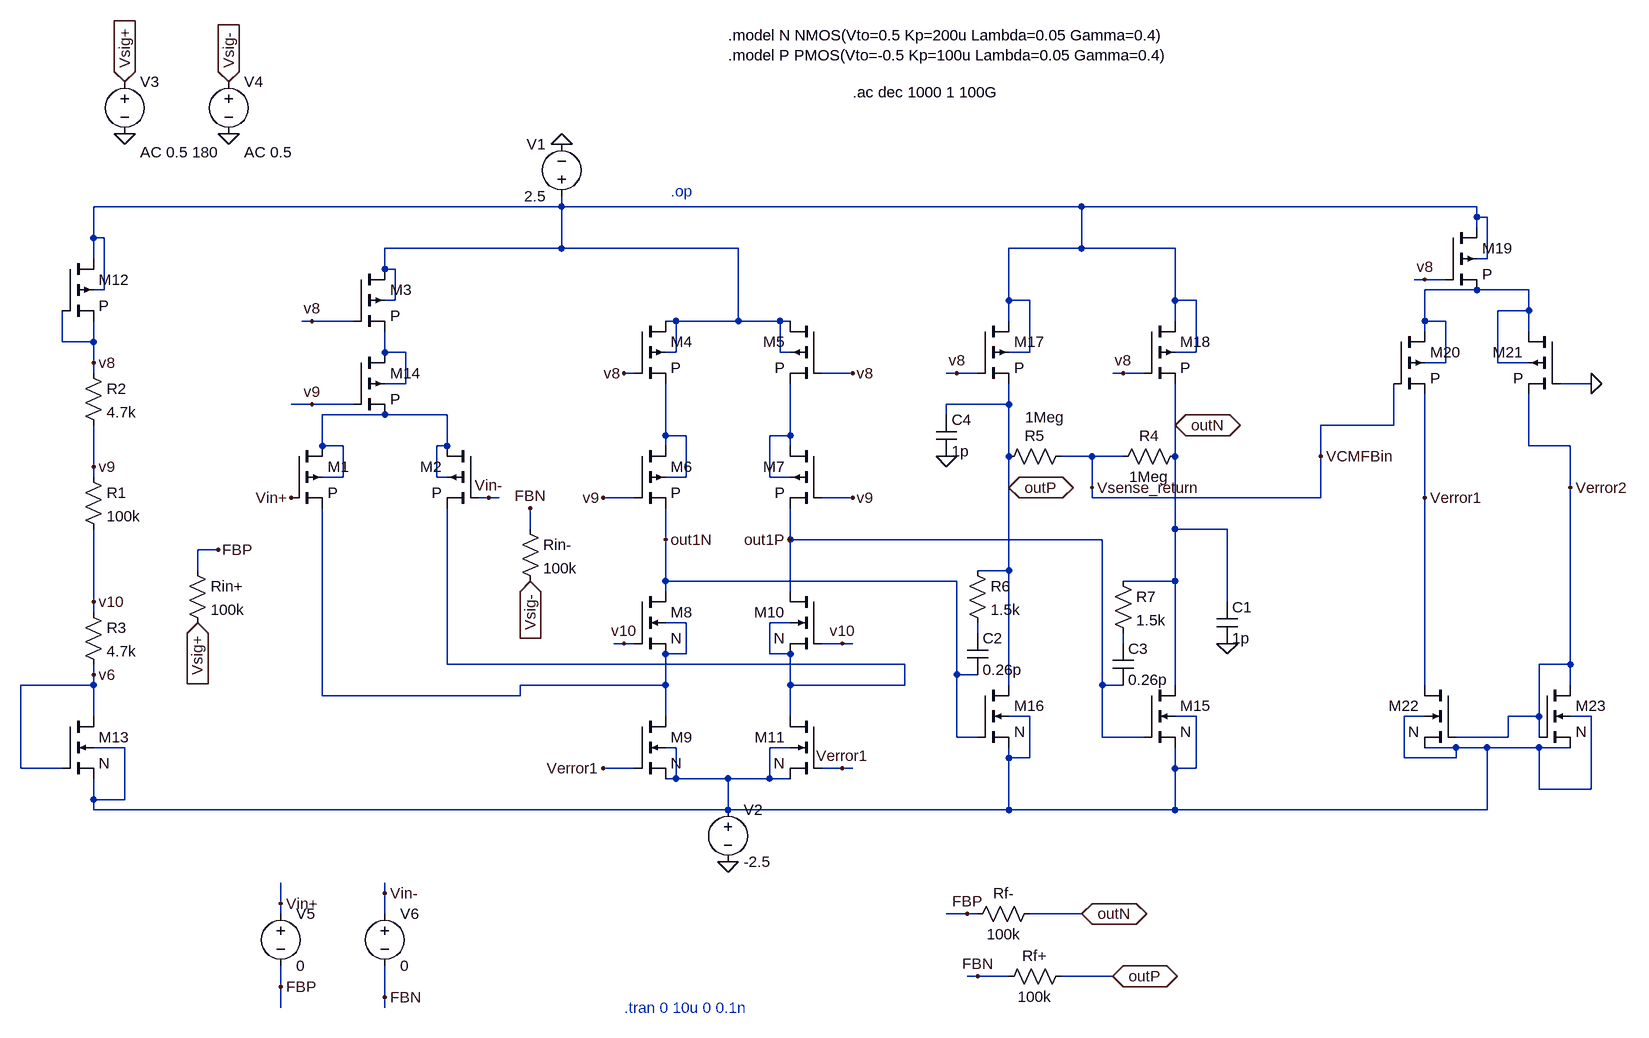
[diagram p0: schematic prototype-final.asc]
prototype-final.asc, the LTspice schematic file:
Version 4.1
SHEET 1 2264 2500
WIRE 560 352 560 336
WIRE 560 352 -160 352
WIRE 1360 352 560 352
WIRE 1968 352 1360 352
WIRE 1968 368 1968 352
WIRE 1984 368 1968 368
WIRE 1968 384 1968 368
WIRE -160 400 -160 352
WIRE -144 400 -160 400
WIRE 560 416 560 352
WIRE 560 416 288 416
WIRE 832 416 560 416
WIRE 1360 416 1360 352
WIRE 1360 416 1248 416
WIRE 1504 416 1360 416
WIRE -160 432 -160 400
WIRE 1984 432 1984 368
WIRE 1984 432 1968 432
WIRE 288 448 288 416
WIRE 304 448 288 448
WIRE 1888 464 1872 464
WIRE 1920 464 1888 464
WIRE -144 480 -144 400
WIRE -144 480 -160 480
WIRE 1968 480 1888 480
WIRE 2048 480 1968 480
WIRE 304 496 304 448
WIRE 304 496 288 496
WIRE 1248 496 1248 416
WIRE 1280 496 1248 496
WIRE 1504 496 1504 416
WIRE 1536 496 1504 496
WIRE 2048 512 2048 480
WIRE 2048 512 2000 512
WIRE 176 528 160 528
WIRE 240 528 176 528
WIRE 736 528 720 528
WIRE 832 528 832 416
WIRE 832 528 736 528
WIRE 896 528 832 528
WIRE 912 528 896 528
WIRE 1248 528 1248 496
WIRE 1504 528 1504 496
WIRE 1888 528 1888 480
WIRE 1920 528 1888 528
WIRE 1888 544 1888 528
WIRE 2048 544 2048 512
WIRE -208 560 -208 512
WIRE -160 560 -160 528
WIRE -160 560 -208 560
WIRE 288 576 288 544
WIRE 320 576 288 576
WIRE 736 576 736 528
WIRE 736 576 720 576
WIRE 896 576 896 528
WIRE 912 576 896 576
WIRE 1280 576 1280 496
WIRE 1280 576 1248 576
WIRE 1536 576 1536 496
WIRE 1536 576 1504 576
WIRE -160 592 -160 560
WIRE 1920 592 1920 528
WIRE 1920 592 1888 592
WIRE 2000 592 2000 512
WIRE 2048 592 2000 592
WIRE -160 608 -160 592
WIRE 672 608 656 608
WIRE 1008 608 960 608
WIRE 1168 608 1152 608
WIRE 1200 608 1168 608
WIRE 1424 608 1408 608
WIRE 1456 608 1424 608
WIRE 320 624 320 576
WIRE 320 624 288 624
WIRE 2144 624 2096 624
WIRE 176 656 144 656
WIRE 240 656 176 656
WIRE 1248 656 1248 624
WIRE 1248 656 1152 656
WIRE 288 672 192 672
WIRE 384 672 288 672
WIRE 1152 672 1152 656
WIRE 1504 688 1504 624
WIRE 1840 688 1840 624
WIRE 1840 688 1728 688
WIRE 720 704 720 624
WIRE 752 704 720 704
WIRE 912 704 912 624
WIRE 912 704 880 704
WIRE 192 720 192 672
WIRE 224 720 192 720
WIRE 384 720 384 672
WIRE 384 720 368 720
WIRE 720 720 720 704
WIRE 912 720 912 704
WIRE 2048 720 2048 640
WIRE 2112 720 2048 720
WIRE 1248 736 1248 656
WIRE 1376 736 1328 736
WIRE 1424 736 1376 736
WIRE 1504 736 1504 688
WIRE 1728 736 1728 688
WIRE -160 752 -160 688
WIRE -160 768 -160 752
WIRE 224 768 224 720
WIRE 224 768 192 768
WIRE 368 768 368 720
WIRE 384 768 368 768
WIRE 752 768 752 704
WIRE 752 768 720 768
WIRE 880 768 880 704
WIRE 912 768 880 768
WIRE 1248 784 1248 736
WIRE 1376 784 1376 736
WIRE 2112 784 2112 720
WIRE 448 800 432 800
WIRE 464 800 448 800
WIRE 672 800 624 800
WIRE 1008 800 960 800
WIRE 1376 800 1376 784
WIRE 1728 800 1728 736
WIRE 1728 800 1376 800
WIRE 1888 800 1888 640
WIRE 512 848 512 816
WIRE 1504 848 1504 736
WIRE 1584 848 1504 848
WIRE 720 864 720 816
WIRE 912 864 912 816
WIRE 1392 864 912 864
WIRE 32 880 0 880
WIRE 0 912 0 880
WIRE 1248 912 1248 784
WIRE 1248 912 1200 912
WIRE 720 928 720 864
WIRE 1168 928 720 928
WIRE 1504 928 1504 848
WIRE 1504 928 1424 928
WIRE 720 944 720 928
WIRE 912 944 912 864
WIRE -160 960 -160 848
WIRE 1584 960 1584 848
WIRE -160 976 -160 960
WIRE 752 992 720 992
WIRE 912 992 880 992
WIRE 1200 1008 1200 992
WIRE 656 1024 640 1024
WIRE 672 1024 656 1024
WIRE 992 1024 960 1024
WIRE 1008 1024 992 1024
WIRE 1424 1024 1424 1008
WIRE 752 1040 752 992
WIRE 752 1040 720 1040
WIRE 880 1040 880 992
WIRE 912 1040 880 1040
WIRE 384 1056 384 816
WIRE 1088 1056 384 1056
WIRE 2112 1056 2112 784
WIRE 2112 1056 2064 1056
WIRE -160 1072 -160 1056
WIRE 1168 1072 1168 928
WIRE 1200 1072 1168 1072
WIRE -160 1088 -160 1072
WIRE -160 1088 -272 1088
WIRE 720 1088 720 1040
WIRE 720 1088 496 1088
WIRE 912 1088 912 1040
WIRE 1088 1088 1088 1056
WIRE 1088 1088 912 1088
WIRE 1248 1088 1248 912
WIRE 1392 1088 1392 864
WIRE 1424 1088 1392 1088
WIRE 1504 1088 1504 928
WIRE 1888 1088 1888 800
WIRE 2112 1088 2112 1056
WIRE 192 1104 192 816
WIRE 496 1104 496 1088
WIRE 496 1104 192 1104
WIRE -160 1136 -160 1088
WIRE 720 1136 720 1088
WIRE 912 1136 912 1088
WIRE 1280 1136 1248 1136
WIRE 1536 1136 1504 1136
WIRE 1888 1136 1856 1136
WIRE 2064 1136 2064 1056
WIRE 2064 1136 2016 1136
WIRE 2144 1136 2112 1136
WIRE 1168 1168 1168 1072
WIRE 1200 1168 1168 1168
WIRE 1392 1168 1392 1088
WIRE 1456 1168 1392 1168
WIRE 2016 1168 2016 1136
WIRE 2016 1168 1936 1168
WIRE 2064 1168 2064 1136
WIRE -112 1184 -160 1184
WIRE 736 1184 720 1184
WIRE 912 1184 880 1184
WIRE 1936 1184 1888 1184
WIRE 1984 1184 1936 1184
WIRE 2064 1184 1984 1184
WIRE 2112 1184 2064 1184
WIRE 1248 1200 1248 1184
WIRE 1280 1200 1280 1136
WIRE 1280 1200 1248 1200
WIRE 1856 1200 1856 1136
WIRE 1936 1200 1936 1184
WIRE 1936 1200 1856 1200
WIRE -272 1216 -272 1088
WIRE -208 1216 -272 1216
WIRE 672 1216 624 1216
WIRE 992 1216 960 1216
WIRE 1008 1216 992 1216
WIRE 1504 1216 1504 1184
WIRE 1536 1216 1536 1136
WIRE 1536 1216 1504 1216
WIRE 736 1232 736 1184
WIRE 736 1232 720 1232
WIRE 816 1232 736 1232
WIRE 880 1232 880 1184
WIRE 880 1232 816 1232
WIRE 912 1232 880 1232
WIRE 2064 1248 2064 1184
WIRE 2144 1248 2144 1136
WIRE 2144 1248 2064 1248
WIRE -160 1264 -160 1232
WIRE -112 1264 -112 1184
WIRE -112 1264 -160 1264
WIRE -160 1280 -160 1264
WIRE 816 1280 816 1232
WIRE 816 1280 -160 1280
WIRE 1248 1280 1248 1200
WIRE 1248 1280 816 1280
WIRE 1504 1280 1504 1216
WIRE 1504 1280 1248 1280
WIRE 1984 1280 1984 1184
WIRE 1984 1280 1504 1280
WIRE 288 1408 288 1392
WIRE 128 1424 128 1392
WIRE 128 1440 128 1424
WIRE 288 1440 288 1408
WIRE 1184 1440 1152 1440
WIRE 1200 1440 1184 1440
WIRE 1360 1440 1280 1440
WIRE 1200 1536 1184 1536
WIRE 1248 1536 1200 1536
WIRE 1408 1536 1328 1536
WIRE 128 1552 128 1520
WIRE 288 1568 288 1520
WIRE 128 1584 128 1552
WIRE 288 1584 288 1568
FLAG 560 256 0
FLAG 816 1360 0
FLAG -112 240 0
FLAG 48 240 0
FLAG -112 160 Vsig+
IOPIN -112 160 In
FLAG 48 160 Vsig-
IOPIN 48 160 In
FLAG -160 592 v8
FLAG 656 608 v8
FLAG 1008 608 v8
FLAG -160 752 v9
FLAG 624 800 v9
FLAG 1008 800 v9
FLAG -160 960 v10
FLAG 656 1024 v10
FLAG 992 1024 v10
FLAG -160 1072 v6
FLAG 176 528 v8
FLAG 176 656 v9
FLAG 912 864 out1P
FLAG 720 864 out1N
FLAG 1168 608 v8
FLAG 1424 608 v8
FLAG 1584 1024 0
FLAG 1504 688 outN
IOPIN 1504 688 BiDir
FLAG 1248 784 outP
IOPIN 1248 784 BiDir
FLAG 1152 736 0
FLAG 1376 784 Vsense_return
FLAG 1888 464 v8
FLAG 2144 624 0
FLAG 1888 800 Verror1
FLAG 2112 784 Verror2
FLAG 624 1216 Verror1
FLAG 992 1216 Verror1
FLAG 0 992 Vsig+
IOPIN 0 992 In
FLAG 512 928 Vsig-
IOPIN 512 928 In
FLAG 144 800 Vin+
FLAG 448 800 Vin-
FLAG 1360 1440 outN
IOPIN 1360 1440 BiDir
FLAG 1408 1536 outP
IOPIN 1408 1536 BiDir
FLAG 1184 1440 FBP
FLAG 1200 1536 FBN
FLAG 128 1424 Vin+
FLAG 288 1408 Vin-
FLAG 128 1552 FBP
FLAG 288 1568 FBN
FLAG 32 880 FBP
FLAG 512 816 FBN
FLAG 1728 736 VCMFBin
DATAFLAG -192 560 ""
DATAFLAG -256 1088 ""
DATAFLAG 1168 1152 ""
DATAFLAG 1248 1232 ""
DATAFLAG 1248 1072 ""
DATAFLAG -160 704 ""
DATAFLAG -160 912 ""
SYMBOL pmos4 144 720 R0
SYMATTR InstName M1
SYMATTR Value P
SYMATTR Value2 l=2u w=50u
SYMBOL pmos4 432 720 M0
SYMATTR InstName M2
SYMATTR Value P
SYMATTR Value2 l=2u w=50u
SYMBOL pmos4 240 448 R0
SYMATTR InstName M3
SYMATTR Value P
SYMATTR Value2 l=2u w=100u
SYMBOL voltage 560 352 R180
WINDOW 0 24 96 Left 2
WINDOW 3 24 16 Left 2
WINDOW 123 0 0 Left 0
WINDOW 39 0 0 Left 0
SYMATTR InstName V1
SYMATTR Value 2.5
SYMBOL pmos4 672 528 R0
SYMATTR InstName M4
SYMATTR Value P
SYMATTR Value2 l=2u w=50u
SYMBOL pmos4 960 528 M0
SYMATTR InstName M5
SYMATTR Value P
SYMATTR Value2 l=2u w=50u
SYMBOL pmos4 672 720 R0
SYMATTR InstName M6
SYMATTR Value P
SYMATTR Value2 l=2u w=50u
SYMBOL pmos4 960 720 M0
SYMATTR InstName M7
SYMATTR Value P
SYMATTR Value2 l=2u w=50u
SYMBOL nmos4 672 944 R0
SYMATTR InstName M8
SYMATTR Value N
SYMATTR Value2 l=2u w=25u
SYMBOL nmos4 672 1136 R0
SYMATTR InstName M9
SYMATTR Value N
SYMATTR Value2 l=2u w=50u
SYMBOL nmos4 960 944 M0
SYMATTR InstName M10
SYMATTR Value N
SYMATTR Value2 l=2u w=25u
SYMBOL nmos4 960 1136 M0
SYMATTR InstName M11
SYMATTR Value N
SYMATTR Value2 l=2u w=50u
SYMBOL voltage 816 1264 R0
WINDOW 123 0 0 Left 0
WINDOW 39 0 0 Left 0
SYMATTR InstName V2
SYMATTR Value -2.5
SYMBOL voltage -112 144 R0
WINDOW 123 24 124 Left 2
WINDOW 39 0 0 Left 0
SYMATTR Value2 AC 0.5 180
SYMATTR InstName V3
SYMATTR Value ""
SYMBOL voltage 48 144 R0
WINDOW 123 24 124 Left 2
WINDOW 39 0 0 Left 0
SYMATTR Value2 AC 0.5
SYMATTR InstName V4
SYMATTR Value ""
SYMBOL pmos4 -208 432 R0
SYMATTR InstName M12
SYMATTR Value P
SYMATTR Value2 l=2u w=100u
SYMBOL nmos4 -208 1136 R0
SYMATTR InstName M13
SYMATTR Value N
SYMATTR Value2 l=2u w=50u
SYMBOL res -176 752 R0
SYMATTR InstName R1
SYMATTR Value 100k
SYMBOL res -176 592 R0
SYMATTR InstName R2
SYMATTR Value 4.7k
SYMBOL res -176 960 R0
SYMATTR InstName R3
SYMATTR Value 4.7k
SYMBOL pmos4 240 576 R0
SYMATTR InstName M14
SYMATTR Value P
SYMATTR Value2 l=2u w=100u
SYMBOL nmos4 1456 1088 R0
SYMATTR InstName M15
SYMATTR Value N
SYMATTR Value2 l=2u w=100u
SYMBOL nmos4 1200 1088 R0
SYMATTR InstName M16
SYMATTR Value N
SYMATTR Value2 l=2u w=100u
SYMBOL pmos4 1200 528 R0
SYMATTR InstName M17
SYMATTR Value P
SYMATTR Value2 l=2u w=200u
SYMBOL pmos4 1456 528 R0
SYMATTR InstName M18
SYMATTR Value P
SYMATTR Value2 l=2u w=200u
SYMBOL cap 1568 960 R0
SYMATTR InstName C1
SYMATTR Value 1p
SYMBOL cap 1136 672 R0
SYMATTR InstName C4
SYMATTR Value 1p
SYMBOL cap 1184 1008 R0
SYMATTR InstName C2
SYMATTR Value 0.26p
SYMBOL cap 1408 1024 R0
SYMATTR InstName C3
SYMATTR Value 0.26p
SYMBOL res 1520 720 R90
WINDOW 0 0 56 VBottom 2
WINDOW 3 32 56 VTop 2
SYMATTR InstName R4
SYMATTR Value 1Meg
SYMBOL res 1344 720 R90
WINDOW 0 0 56 VBottom 2
WINDOW 3 -60 40 VTop 2
SYMATTR InstName R5
SYMATTR Value 1Meg
SYMBOL pmos4 1920 384 R0
SYMATTR InstName M19
SYMATTR Value P
SYMATTR Value2 l=2u w=200u
SYMBOL pmos4 1840 544 R0
SYMATTR InstName M20
SYMATTR Value P
SYMATTR Value2 l=2u w=200u
SYMBOL pmos4 2096 544 M0
SYMATTR InstName M21
SYMATTR Value P
SYMATTR Value2 l=2u w=200u
SYMBOL nmos4 1936 1088 M0
SYMATTR InstName M22
SYMATTR Value N
SYMATTR Value2 l=2u w=100u
SYMBOL nmos4 2064 1088 R0
SYMATTR InstName M23
SYMATTR Value N
SYMATTR Value2 l=2u w=100u
SYMBOL res 1184 896 R0
SYMATTR InstName R6
SYMATTR Value 1.5k
SYMBOL res 1408 912 R0
SYMATTR InstName R7
SYMATTR Value 1.5k
SYMBOL res 496 832 R0
SYMATTR InstName Rin-
SYMATTR Value 100k
SYMBOL res -16 896 R0
SYMATTR InstName Rin+
SYMATTR Value 100k
SYMBOL res 1296 1424 R90
WINDOW 0 0 56 VBottom 2
WINDOW 3 32 56 VTop 2
SYMATTR InstName Rf-
SYMATTR Value 100k
SYMBOL res 1344 1520 R90
WINDOW 0 0 56 VBottom 2
WINDOW 3 32 56 VTop 2
SYMATTR InstName Rf+
SYMATTR Value 100k
SYMBOL voltage 128 1424 R0
WINDOW 123 24 124 Left 2
WINDOW 39 0 0 Left 0
SYMATTR InstName V5
SYMATTR Value 0
SYMBOL voltage 288 1424 R0
WINDOW 123 24 124 Left 2
WINDOW 39 0 0 Left 0
SYMATTR InstName V6
SYMATTR Value 0
TEXT 816 88 Left 2 !.model N NMOS(Vto=0.5 Kp=200u Lambda=0.05 Gamma=0.4)\n.model P PMOS(Vto=-0.5 Kp=100u Lambda=0.05 Gamma=0.4)
TEXT 728 328 Left 2 ;.op
TEXT 1008 176 Left 2 !.ac dec 1000 1 100G
TEXT 656 1584 Left 2 ;.tran 0 10u 0 0.1n

The netlist it stands for:
* prototype-final.asc
M1 N004 Vin+ N007 N004 P l=2u w=50u
M2 N004 Vin- N008 N004 P l=2u w=50u
M3 N001 v8 N003 N001 P l=2u w=100u
V1 N001 0 2.5
M4 N001 v8 N005 N001 P l=2u w=50u
M5 N001 v8 N006 N001 P l=2u w=50u
M6 N005 v9 out1N N005 P l=2u w=50u
M7 N006 v9 out1P N006 P l=2u w=50u
M8 out1N v10 N007 N007 N l=2u w=25u
M9 N007 Verror1 N011 N011 N l=2u w=50u
M10 out1P v10 N008 N008 N l=2u w=25u
M11 N008 Verror1 N011 N011 N l=2u w=50u
V2 N011 0 -2.5
V3 Vsig+ 0 AC 0.5 180
V4 Vsig- 0 AC 0.5
M12 N001 v8 v8 N001 P l=2u w=100u
M13 v6 v6 N011 N011 N l=2u w=50u
R1 v9 v10 100k
R2 v8 v9 4.7k
R3 v10 v6 4.7k
M14 N003 v9 N004 N003 P l=2u w=100u
M15 outN out1P N011 N011 N l=2u w=100u
M16 outP out1N N011 N011 N l=2u w=100u
M17 N001 v8 outP N001 P l=2u w=200u
M18 N001 v8 outN N001 P l=2u w=200u
C1 outN 0 1p
C4 outP 0 1p
C2 N009 out1N 0.26p
C3 N010 out1P 0.26p
R4 outN VCMFBin 1Meg
R5 VCMFBin outP 1Meg
M19 N001 v8 N002 N001 P l=2u w=200u
M20 N002 VCMFBin Verror1 N002 P l=2u w=200u
M21 N002 0 Verror2 N002 P l=2u w=200u
M22 Verror1 Verror2 N011 N011 N l=2u w=100u
M23 Verror2 Verror2 N011 N011 N l=2u w=100u
R6 outP N009 1.5k
R7 outN N010 1.5k
Rin- FBN Vsig- 100k
Rin+ FBP Vsig+ 100k
Rf- outN FBP 100k
Rf+ outP FBN 100k
V5 Vin+ FBP 0
V6 Vin- FBN 0
.model NMOS NMOS
.model PMOS PMOS
.lib standard.mos
.model N NMOS(Vto=0.5 Kp=200u Lambda=0.05 Gamma=0.4)
.model P PMOS(Vto=-0.5 Kp=100u Lambda=0.05 Gamma=0.4)
* .op
.ac dec 1000 1 100G
* .tran 0 10u 0 0.1n
.backanno
.end